# EAGLE schematic Pip Boy (EAGLE 7.7.0)
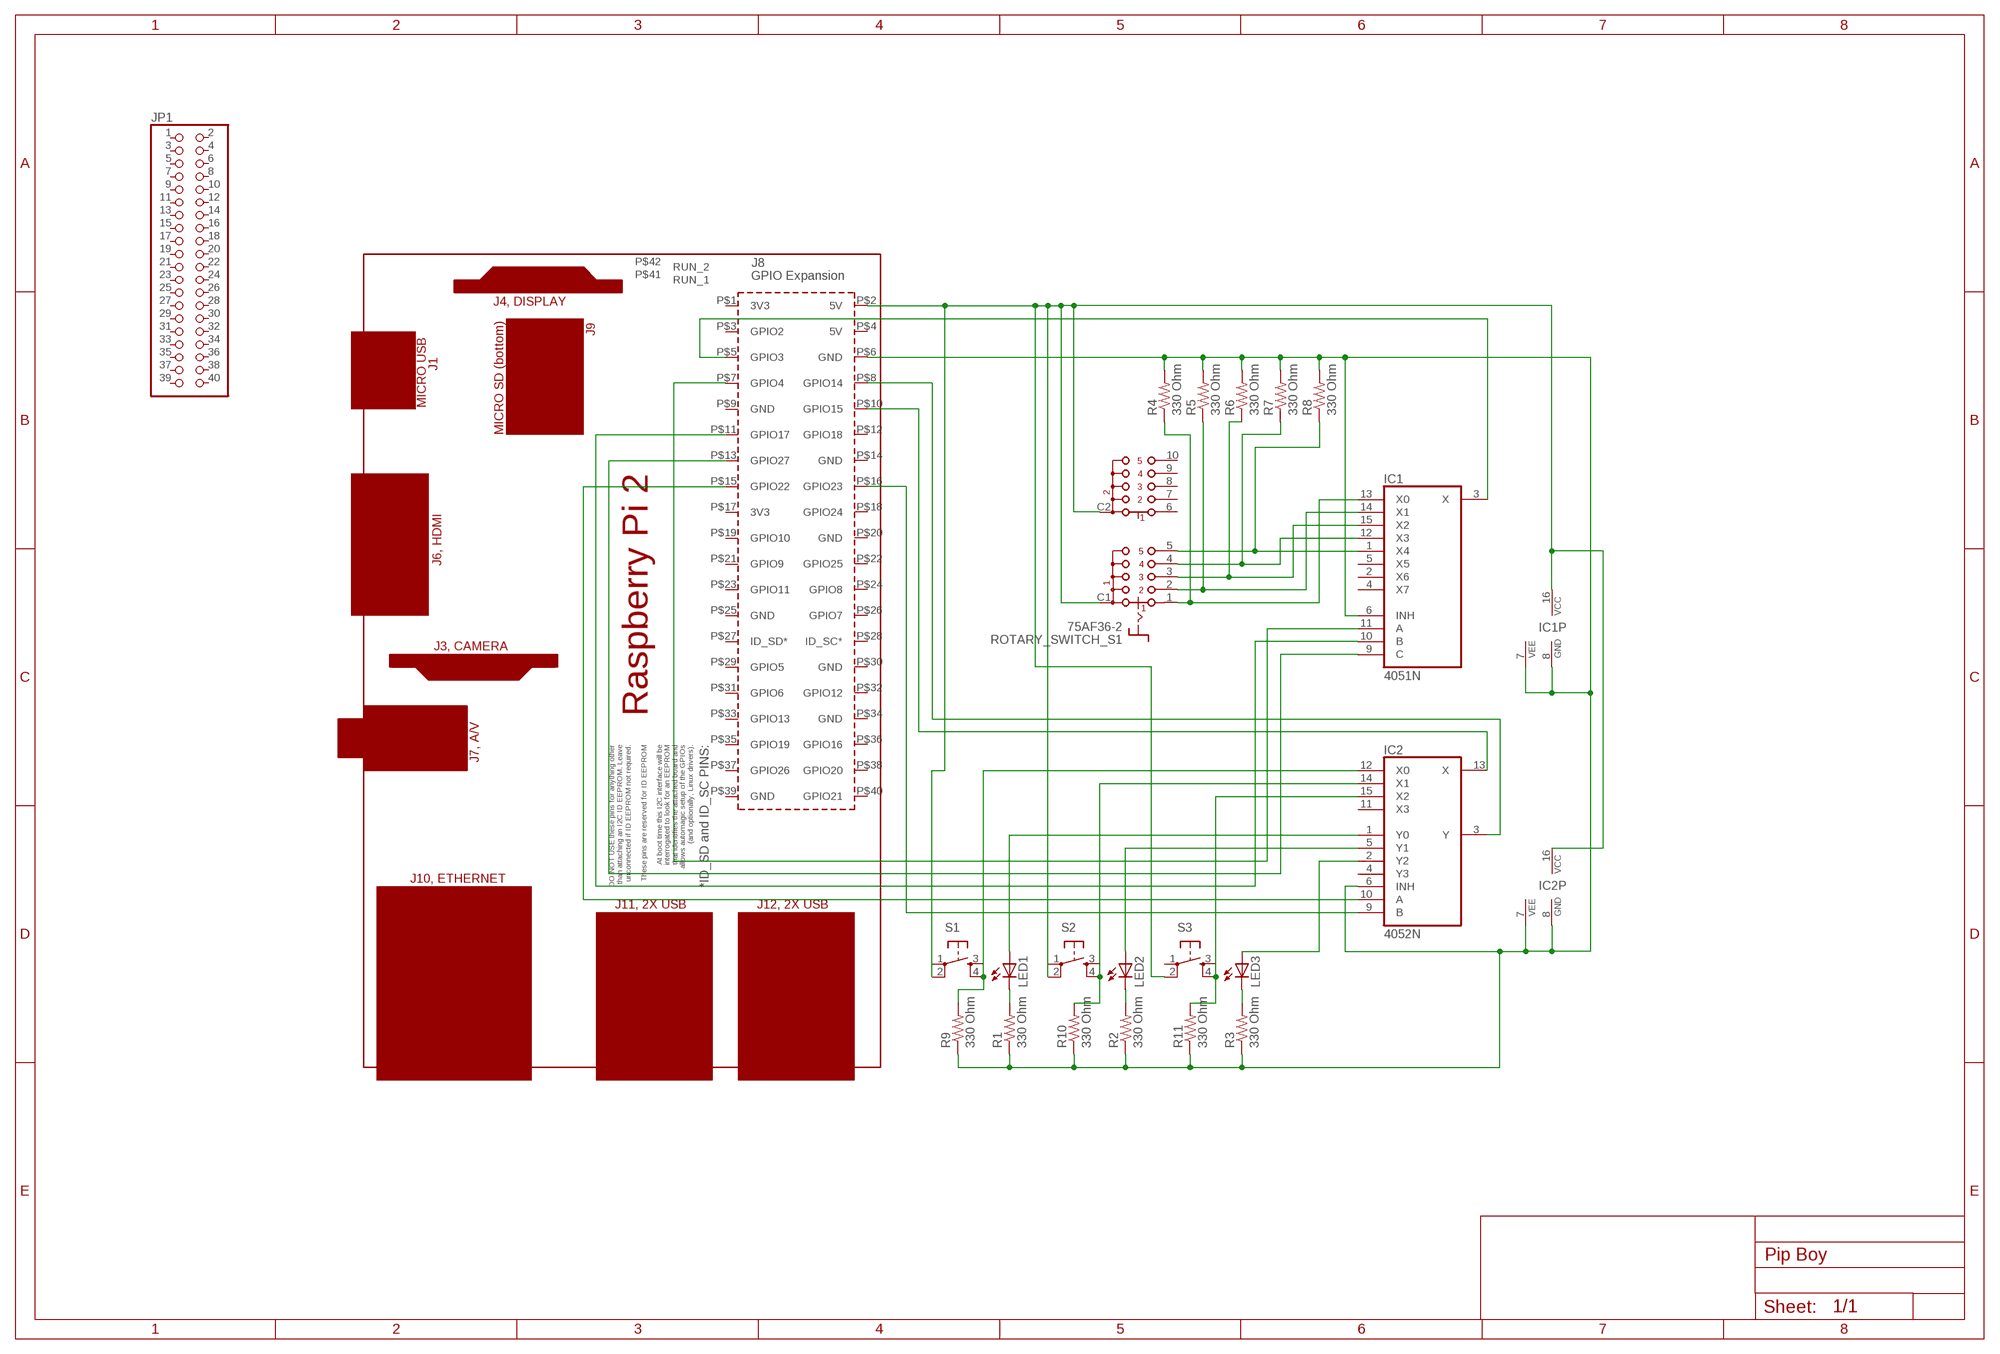
[diagram p0: schematic, sheet 1]

## Parts
IC1  4051N  [DIL16]
IC2  4052N  [DIL16]
JP1  PINHD-2X20  [2X20]
LED1  LED3MM  [LED3MM]
LED2  LED3MM  [LED3MM]
LED3  LED3MM  [LED3MM]
PCB1  RPI2  [RPI2]
R1  330 Ohm  FLIPFLOP-RES  [0805-THM]
R2  330 Ohm  FLIPFLOP-RES  [0805-THM]
R3  330 Ohm  FLIPFLOP-RES  [0805-THM]
R4  330 Ohm  FLIPFLOP-RES  [0805-THM]
R5  330 Ohm  FLIPFLOP-RES  [0805-THM]
R6  330 Ohm  FLIPFLOP-RES  [0805-THM]
R7  330 Ohm  FLIPFLOP-RES  [0805-THM]
R8  330 Ohm  FLIPFLOP-RES  [0805-THM]
R9  330 Ohm  FLIPFLOP-RES  [0805-THM]
R10  330 Ohm  FLIPFLOP-RES  [0805-THM]
R11  330 Ohm  FLIPFLOP-RES  [0805-THM]
ROTARY_SWITCH_S1  75AF36-2  [75AF36-2]
S1  TAC_SWITCHPTH  [TACTILE-PTH]
S2  TAC_SWITCHPTH  [TACTILE-PTH]
S3  TAC_SWITCHPTH  [TACTILE-PTH]

## Nets
N$1: IC1.6(INH) IC1.7(VEE) IC1.8(GND) IC2.6(INH) IC2.7(VEE) IC2.8(GND) PCB1.P$6(GND) R1.1 R2.1 R3.1 R4.2 R5.2 R6.2 R7.2 R8.2 R9.1 R10.1 R11.1
N$2: IC1.16(VCC) IC2.16(VCC) PCB1.P$2(5V) ROTARY_SWITCH_S1.C1 ROTARY_SWITCH_S1.C2 S1.2 S2.2 S3.2
N$3: IC1.3(X) PCB1.P$5(GPIO3)
N$4: IC1.13(X0) R4.1 ROTARY_SWITCH_S1.1
N$5: IC1.14(X1) R5.1 ROTARY_SWITCH_S1.2
N$6: IC1.15(X2) R6.1 ROTARY_SWITCH_S1.3
N$7: IC1.12(X3) R7.1 ROTARY_SWITCH_S1.4
N$8: IC1.1(X4) R8.1 ROTARY_SWITCH_S1.5
N$9: IC1.10(B) PCB1.P$11(GPIO17)
N$10: IC1.9(C) PCB1.P$13(GPIO27)
N$11: IC1.11(A) PCB1.P$7(GPIO4)
N$12: IC2.12(X0) R9.2 S1.4
N$13: IC2.13(X) PCB1.P$10(GPIO15)
N$14: IC2.3(Y) PCB1.P$8(GPIO14)
N$15: IC2.10(A) PCB1.P$15(GPIO22)
N$16: IC2.9(B) PCB1.P$16(GPIO23)
N$17: IC2.14(X1) R10.2 S2.4
N$18: IC2.15(X2) R11.2 S3.4
N$19: IC2.1(Y0) LED1.A
N$20: IC2.5(Y1) LED2.A
N$21: IC2.2(Y2) LED3.A
N$22: LED1.K(C) R1.2
N$23: LED2.K(C) R2.2
N$24: LED3.K(C) R3.2
Unconnected: IC1.2(X6) IC1.4(X7) IC1.5(X5) IC2.4(Y3) IC2.11(X3) JP1.1 JP1.2 JP1.3 JP1.4 JP1.5 JP1.6 JP1.7 JP1.8 JP1.9 JP1.10 JP1.11 JP1.12 JP1.13 JP1.14 JP1.15 JP1.16 JP1.17 JP1.18 JP1.19 JP1.20 JP1.21 JP1.22 JP1.23 JP1.24 JP1.25 JP1.26 JP1.27 JP1.28 JP1.29 JP1.30 JP1.31 JP1.32 JP1.33 JP1.34 JP1.35 JP1.36 JP1.37 JP1.38 JP1.39 JP1.40 PCB1.P$1(3V3) PCB1.P$3(GPIO2) PCB1.P$4(5V) PCB1.P$9(GND) PCB1.P$12(GPIO18) PCB1.P$14(GND) PCB1.P$17(3V3) PCB1.P$18(GPIO24) PCB1.P$19(GPIO10) PCB1.P$20(GND) PCB1.P$21(GPIO9) PCB1.P$22(GPIO25) PCB1.P$23(GPIO11) PCB1.P$24(GPIO8) PCB1.P$25(GND) PCB1.P$26(GPIO7) PCB1.P$27(ID_SD*) PCB1.P$28(ID_SC*) PCB1.P$29(GPIO5) PCB1.P$30(GND) PCB1.P$31(GPIO6) PCB1.P$32(GPIO12) PCB1.P$33(GPIO13) PCB1.P$34(GND) PCB1.P$35(GPIO19) PCB1.P$36(GPIO16) PCB1.P$37(GPIO26) PCB1.P$38(GPIO20) PCB1.P$39(GND) PCB1.P$40(GPIO21) PCB1.P$41(RUN_1) PCB1.P$42(RUN_2) ROTARY_SWITCH_S1.6 ROTARY_SWITCH_S1.7 ROTARY_SWITCH_S1.8 ROTARY_SWITCH_S1.9 ROTARY_SWITCH_S1.10 S1.1 S1.3 S2.1 S2.3 S3.1 S3.3

## Library data of the parts
IC1 = 40xx:4051: 8-channel ANALOG MULTIPLEXER
IC2 = 40xx:4052: Dual 4-channel ANALOG MULTIPLEXER
JP1 = adafruit:PINHD-2X20: PIN HEADER
LED1-LED3 = led:LED: LED OSRAM: - CHIPLED LG R971, LG N971, LY N971, LG Q971, LY Q971, LO R971, LY R971 LH N974, LH R974 LS Q976, LO Q976, LY Q976 LO Q996 - Hyper CHIPLED LW Q18S LB Q993, LB Q99A, LB R99A - SideLED LS A670, LO A670, LY A670, LG A670, LP A670 LB A673, LV A673, LT A673, LW A673 LH A674 LY A675 LS A676, LA A676, LO A676, LY A676, LW A676 LS A679, LY A679, LG A679 - Hyper Micro SIDELED® LS Y876, LA Y876, LO Y876, LY Y876 LT Y87S - SmartLED LW L88C, LW L88S LB L89C, LB L89S, LG L890 LS L89K, LO L89K, LY L89K LS L896, LA L896, LO L896, LY L896 - TOPLED LS T670, LO T670, LY T670, LG T670, LP T670 LSG T670, LSP T670, LSY T670, LOP T670, LYG T670 LG T671, LOG T671, LSG T671 LB T673, LV T673, LT T673, LW T673 LH T674 LS T676, LA T676, LO T676, LY T676, LB T676, LH T676, LSB T676, LW T676 LB T67C, LV T67C, LT T67C, LS T67K, LO T67K, LY T67K, LW E67C LS E67B, LA E67B, LO E67B, LY E67B, LB E67C, LV E67C, LT E67C LW T67C LS T679, LY T679, LG T679 LS T770, LO T770, LY T770, LG T770, LP T770 LB T773, LV T773, LT T773, LW T773 LH T774 LS E675, LA E675, LY E675, LS T675 LS T776, LA T776, LO T776, LY T776, LB T776 LHGB T686 LT T68C, LB T68C - Hyper Mini TOPLED® LB M676 - Mini TOPLED Santana® LG M470 LS M47K, LO M47K, LY M47K Source: http://www.osram.convergy.de LUXEON: - LUMILED® LXK2-PW12-R00, LXK2-PW12-S00, LXK2-PW14-U00, LXK2-PW14-V00 LXK2-PM12-R00, LXK2-PM12-S00, LXK2-PM14-U00 LXK2-PE12-Q00, LXK2-PE12-R00, LXK2-PE12-S00, LXK2-PE14-T00, LXK2-PE14-U00 LXK2-PB12-K00, LXK2-PB12-L00, LXK2-PB12-M00, LXK2-PB14-N00, LXK2-PB14-P00, LXK2-PB14-Q00 LXK2-PR12-L00, LXK2-PR12-M00, LXK2-PR14-Q00, LXK2-PR14-R00 LXK2-PD12-Q00, LXK2-PD12-R00, LXK2-PD12-S00 LXK2-PH12-R00, LXK2-PH12-S00 LXK2-PL12-P00, LXK2-PL12-Q00, LXK2-PL12-R00 Source: www.luxeon.com KINGBRIGHT: KA-3528ASYC Source: www.kingbright.com
PCB1 = e14_Rpi2_RevA:RPI2: Device for Raspberry Pi 2 board created by www.element14.com More information and support community is available at http://www.element14.com/community/community/raspberry-pi/raspberrypi2
R1-R11 = adafruit:FLIPFLOP-RES: Flip Flop resistor An 0805 resistor inside a standard 1/4W 5% resistor. Makes for easy mods
ROTARY_SWITCH_S1 = switch:75?36-2: Single Deck Rotary Switches Source: www.grayhill.com .. J-13-14.pdf
S1-S3 = SparkFun-Retired:TAC_SWITCH: Momentary Switch Button commonly used for reset or general input. Spark Fun Electronics SKU : COM-00097 SMT- SWCH-08247